# Altium project MPPC_board.PrjPcb
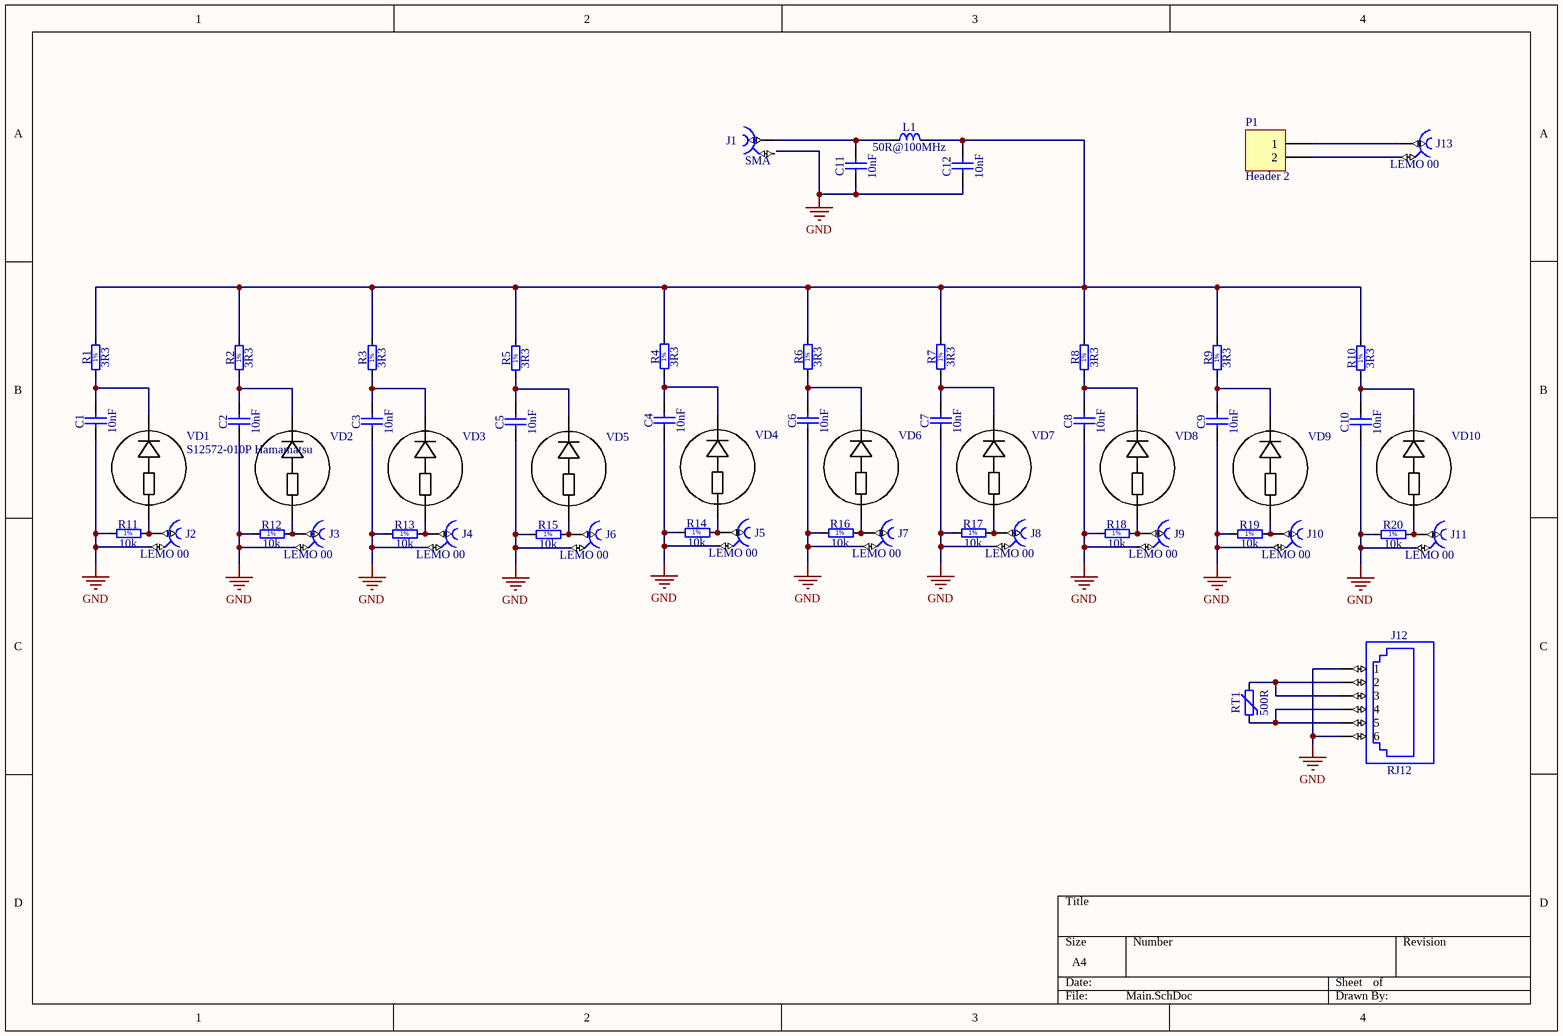
[diagram p0: Main.SchDoc]
1 sheet, 58 parts. Net scope: global (net labels, ports and power ports of the same name join across sheets).
Board file: PCB.PcbDoc

## Sheet Main.SchDoc
size A4

### Parts
C1  10nF  [CAPC2012X135N]
C2  10nF  [CAPC2012X135N]
C3  10nF  [CAPC2012X135N]
C4  10nF  [CAPC2012X135N]
C5  10nF  [CAPC2012X135N]
C6  10nF  [CAPC2012X135N]
C7  10nF  [CAPC2012X135N]
C8  10nF  [CAPC2012X135N]
C9  10nF  [CAPC2012X135N]
C10  10nF  [CAPC2012X135N]
C11  10nF  [CAPC2012X135N]
C12  10nF  [CAPC2012X135N]
J1  SMA  [AMPHENOL_132203]
J2  LEMO 00  [LEMO_EPK.00.250.NTN]
J3  LEMO 00  [LEMO_EPK.00.250.NTN]
J4  LEMO 00  [LEMO_EPK.00.250.NTN]
J5  LEMO 00  [LEMO_EPK.00.250.NTN]
J6  LEMO 00  [LEMO_EPK.00.250.NTN]
J7  LEMO 00  [LEMO_EPK.00.250.NTN]
J8  LEMO 00  [LEMO_EPK.00.250.NTN]
J9  LEMO 00  [LEMO_EPK.00.250.NTN]
J10  LEMO 00  [LEMO_EPK.00.250.NTN]
J11  LEMO 00  [LEMO_EPK.00.250.NTN]
J12  RJ12  [WURTH_615006138521]
J13  LEMO 00  [LEMO_EPK.00.250.NTN]
L1  50R@100MHz  [IND_MURATA_BLM31PG]
P1  Header 2  [HDR1X2]
R1  3R3  [RESC2012X60N]
R2  3R3  [RESC2012X60N]
R3  3R3  [RESC2012X60N]
R4  3R3  [RESC2012X60N]
R5  3R3  [RESC2012X60N]
R6  3R3  [RESC2012X60N]
R7  3R3  [RESC2012X60N]
R8  3R3  [RESC2012X60N]
R9  3R3  [RESC2012X60N]
R10  3R3  [RESC2012X60N]
R11  10k  [RESC2012X60N]
R12  10k  [RESC2012X60N]
R13  10k  [RESC2012X60N]
R14  10k  [RESC2012X60N]
R15  10k  [RESC2012X60N]
R16  10k  [RESC2012X60N]
R17  10k  [RESC2012X60N]
R18  10k  [RESC2012X60N]
R19  10k  [RESC2012X60N]
R20  10k  [RESC2012X60N]
RT1  500R  [RESC2013X64N]
VD1  S12572-010P Hamamatsu  [S12572-010P]
VD2  S12572-010P Hamamatsu  [S12572-010P]  (value not drawn)
VD3  S12572-010P Hamamatsu  [S12572-010P]  (value not drawn)
VD4  S12572-010P Hamamatsu  [S12572-010P]  (value not drawn)
VD5  S12572-010P Hamamatsu  [S12572-010P]  (value not drawn)
VD6  S12572-010P Hamamatsu  [S12572-010P]  (value not drawn)
VD7  S12572-010P Hamamatsu  [S12572-010P]  (value not drawn)
VD8  S12572-010P Hamamatsu  [S12572-010P]  (value not drawn)
VD9  S12572-010P Hamamatsu  [S12572-010P]  (value not drawn)
VD10  S12572-010P Hamamatsu  [S12572-010P]  (value not drawn)

### Nets
GND: C1.1 C2.1 C3.1 C4.1 C5.1 C6.1 C7.1 C8.1 C9.1 C10.1 C11.1 C12.1 J2.2 J3.2 J4.2 J5.2 J6.2 J7.2 J8.2 J9.2 J10.2 J11.2 J12.1 J12.6 R11.1 R12.1 R13.1 R14.1 R15.1 R16.1 R17.1 R18.1 R19.1 R20.1
NetC1_2: C1.2 R1.1 VD1.2(C)
NetC2_2: C2.2 R2.1 VD2.2(C)
NetC3_2: C3.2 R3.1 VD3.2(C)
NetC4_2: C4.2 R4.1 VD4.2(C)
NetC5_2: C5.2 R5.1 VD5.2(C)
NetC6_2: C6.2 R6.1 VD6.2(C)
NetC7_2: C7.2 R7.1 VD7.2(C)
NetC8_2: C8.2 R8.1 VD8.2(C)
NetC9_2: C9.2 R9.1 VD9.2(C)
NetC10_2: C10.2 R10.1 VD10.2(C)
NetC11_2: C11.2 J1.1 L1.1
NetC12_2: C12.2 L1.2 R1.2 R2.2 R3.2 R4.2 R5.2 R6.2 R7.2 R8.2 R9.2 R10.2
NetJ2_1: J2.1 R11.2 VD1.1(A)
NetJ3_1: J3.1 R12.2 VD2.1(A)
NetJ4_1: J4.1 R13.2 VD3.1(A)
NetJ5_1: J5.1 R14.2 VD4.1(A)
NetJ6_1: J6.1 R15.2 VD5.1(A)
NetJ7_1: J7.1 R16.2 VD6.1(A)
NetJ8_1: J8.1 R17.2 VD7.1(A)
NetJ9_1: J9.1 R18.2 VD8.1(A)
NetJ10_1: J10.1 R19.2 VD9.1(A)
NetJ11_1: J11.1 R20.2 VD10.1(A)
NetJ12_2: J12.2 J12.3 RT1.2
NetJ12_4: J12.4 J12.5 RT1.1
NetJ13_1: J13.1 P1.1
NetJ13_2: J13.2 P1.2

Not connected (* = marked no-connect by the designer): J1 2

### Notes on the sheet
- (in symbol R0805_3R3_1%_0.125W_200PPM) 1%
- (in symbol R0805_10K_1%_0.125W_100PPM) 1%

### Library data of the parts
C1-C12 = CC0805_10NF_50V_5%_X7R: Non-polarised capacitor; Part Description: SMD Multilayer Chip Ceramic Capacitor; Manufacturer: GENERIC; Manufacturer1 Part Number: 08055C103JAT2A; Voltage: 50V; TC: X7R; Tolerance: ±5%; Part Number: CC0805_10NF_50V_5%_X7R; Component Kind: Standard; Component Type: Standard; Pin Count: 2; Value: 10nF; Status: None; Manufacturer Part Number: CC0805_10NF_50V_5%_X7R; Case: 0805; Mounted: Yes; Socket: No; SMD: Yes; Sense: No; Manufacturer1 Example: AVX; Manufacturer1 ComponentHeight: 0.94mm; HelpURL: \\cern.ch\dfs\Applications\Altium\Datasheets\CC0805_X7R_AVX.pdf; Author: CERN DEM JLC; CreateDate: 18.01.2011; LatestRevisionDate: 18.01.2011
J1 = AMPHENOL_132203: Part Description: 50 Ohm Through Hole SMA Right Angle PCB Jack; Manufacturer Part Number: 132203; PressFit: No; Part Number: AMPHENOL_132203; Component Kind: Standard; Component Type: Standard; Pin Count: 5; Family: SMA; Mounted: Yes; Socket: No; SMD: No; Sense: No; Status: None; Manufacturer: AMPHENOL; ComponentHeight: 10.44mm; HelpURL: \\cern.ch\dfs\Applications\Altium\Datasheets\AMPHENOL_132203.pdf; Author: CERN DEM MR; CreateDate: 06.10.2016; LatestRevisionDate: 06.10.2016
J2-J11 J13 = LEMO_EPK.00.250.NTN: Part Description: Size 00, 50 Ohms Coaxial Elbow (90°) socket With Clearance Under The Body; PressFit: No; SCEM: 09.46.11.180.6; Part Number: LEMO_EPK.00.250.NTN; Component Kind: Standard; Component Type: Standard; Pin Count: 2; Family: LEMO 00; Mounted: Yes; Socket: No; SMD: No; Sense: No; Status: None; Manufacturer: LEMO; Manufacturer Part Number: EPK.00.250.NTN; ComponentHeight: 7mm; HelpURL: \\cern.ch\dfs\Applications\Altium\Datasheets\LEMO_EPK.00.250.NTN.pdf; Author: CERN DEM JLC; CreateDate: 04.09.2012; LatestRevisionDate: 04.09.2012
J12 = WURTH_615006138521: Connector RJ12 (6P6C); Part Description: 1 Port RJ12 Connector, 6P6C,  Straight With Ears; Manufacturer: WURTH ELEKTRONIK; PressFit: No; Part Number: WURTH_615006138521; Component Kind: Standard; Component Type: Standard; Pin Count: 6; Family: RJ12; Mounted: Yes; Socket: No; SMD: No; Sense: No; Status: None; Manufacturer Part Number: 615006138521; ComponentHeight: 16.15mm; HelpURL: \\cern.ch\dfs\Applications\Altium\Datasheets\WURTH_615006138521.pdf; Author: CERN DEM MR; CreateDate: 15.03.2016; LatestRevisionDate: 15.03.2016
L1 = IND1206_MURATA_BLM31PG500SN1: Inductor; Part Description: SMD EMIFIL Chip Ferrite Bead; Manufacturer: MURATA; Power: 3.5A; Resistance: 0.015R; Part Number: IND1206_MURATA_BLM31PG500SN1; Component Kind: Standard; Component Type: Standard; Pin Count: 2; Value: 50R@100MHz; Status: None; Manufacturer Part Number: BLM31PG500SN1; Case: 1206; Mounted: Yes; Socket: No; SMD: Yes; Sense: No; ComponentHeight: 1.3mm; HelpURL: \\cern.ch\dfs\Applications\Altium\Datasheets\IND1206_MURATA_BLM31P.pdf; Author: CERN DEM JLC; CreateDate: 05.12.2013; LatestRevisionDate: 05.12.2013
P1 = Header 2: Header, 2-Pin; LatestRevisionDate: 17-Jul-2002; LatestRevisionNote: Re-released for DXP Platform.; Publisher: Altium Limited
R1-R10 = R0805_3R3_1%_0.125W_200PPM: Resistor - 1%; Part Description: General Purpose Thick Film Chip Resistor; Manufacturer: GENERIC; Manufacturer1 Part Number: 232273463308L or RC0805FR-073R3L; Power: 0.125W; TC: ±200ppm/°C; PressFit: No; Part Number: R0805_3R3_1%_0.125W_200PPM; Component Kind: Standard; Component Type: Standard; Pin Count: 2; Value: 3R3; Status: Preferred; Tolerance: ±1%; Manufacturer Part Number: R0805_3R3_1%_0.125W_200PPM; Case: 0805; Mounted: Yes; Sense: No; Socket: No; SMD: Yes; Manufacturer1 Example: YAGEO PHYCOMP; Manufacturer1 ComponentHeight: 0.65mm; HelpURL: \\cern.ch\dfs\Applications\Altium\Datasheets\R0805_Phycomp_RC0805.pdf; Author: CERN DEM JLC; CreateDate: 03.12.2007; LatestRevisionDate: 17.10.2012
R11-R20 = R0805_10K_1%_0.125W_100PPM: Resistor - 1%; Part Description: General Purpose Thick Film Chip Resistor; Manufacturer: GENERIC; Manufacturer1 Part Number: NRC10F1002TRF; Power: 0.125W; TC: ±100ppm/°C; PressFit: No; Part Number: R0805_10K_1%_0.125W_100PPM; Component Kind: Standard; Component Type: Standard; Pin Count: 2; Value: 10k; Status: Preferred; Tolerance: ±1%; Manufacturer Part Number: R0805_10K_1%_0.125W_100PPM; Case: 0805; Mounted: Yes; Sense: No; Socket: No; SMD: Yes; Manufacturer1 Example: NIC COMPONENT; Manufacturer1 ComponentHeight: 0.6mm; HelpURL: \\cern.ch\dfs\Applications\Altium\Datasheets\R0805_NIC_NRC.pdf; Author: CERN DEM JLC; CreateDate: 03.12.2007; LatestRevisionDate: 13.03.2008
RT1 = THERM_PTC_500R_EPCOS_B59755B0115A070: Thermistor NTC (Positive Temperature Coefficient); Part Description: PTC Thermistors for Overcurrent Protection; Manufacturer: EPCOS; Power: 28mA; Voltage: 500VDC; Tolerance: ±25%; Part Number: THERM_PTC_500R_EPCOS_B59755B0115A070; Component Kind: Standard; Component Type: Standard; Footprint: THERM_EPCOS_B75x; Pin Count: 2; Value: 500R; Status: None; Manufacturer Part Number: B59755B0115A070; Mounted: Yes; Socket: No; SMD: No; Sense: No; ComponentHeight: 16.5mm; HelpURL: \\cern.ch\dfs\Applications\Altium\Datasheets\THERM_EPCOS_B5975xx.pdf; Author: CERN DEM BC; CreateDate: 13.11.2015; LatestRevisionDate: 13.11.2015
VD1-VD10 = S12572-010P: Name: S12572-010P; Manufacturer: Hamamatsu